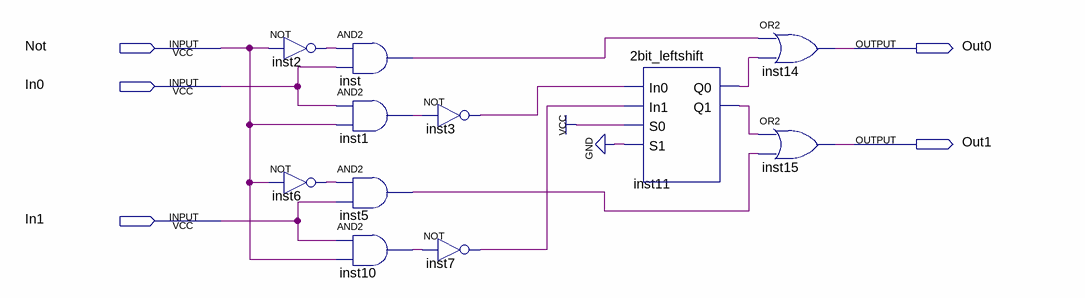
[diagram p0: schematic sheet]
// Quartus schematic NotSelect.bdf as structural Verilog: 11 symbols, 5 pins
module NotSelect (
  input  Not,
  input  In0,
  input  In1,
  output Out0,
  output Out1
);

  wire inst1_out, inst2_out, inst3_out, inst5_out, inst6_out, inst7_out, inst10_out, inst11_q0, inst11_q1,
       inst_out;

  not inst2 (inst2_out, Not);
  not inst6 (inst6_out, Not);
  and inst (inst_out, inst2_out, In0);
  and inst1 (inst1_out, In0, Not);
  and inst5 (inst5_out, inst6_out, In1);
  and inst10 (inst10_out, In1, Not);
  not inst3 (inst3_out, inst1_out);
  not inst7 (inst7_out, inst10_out);
  \2bit_leftshift  inst11 (.In0(inst3_out), .S0(1'b1), .In1(inst7_out), .S1(1'b0), .Q0(inst11_q0), .Q1(inst11_q1));
  or inst14 (Out0, inst_out, inst11_q0);
  or inst15 (Out1, inst11_q1, inst5_out);
endmodule
